# Altium schematic sheet 03_ICs.SchDoc: ICs
size A; Revision: A; SheetNumber: 3; SheetTotal: 4; ECE315_Project_Name: ECE453 F23 Base Project
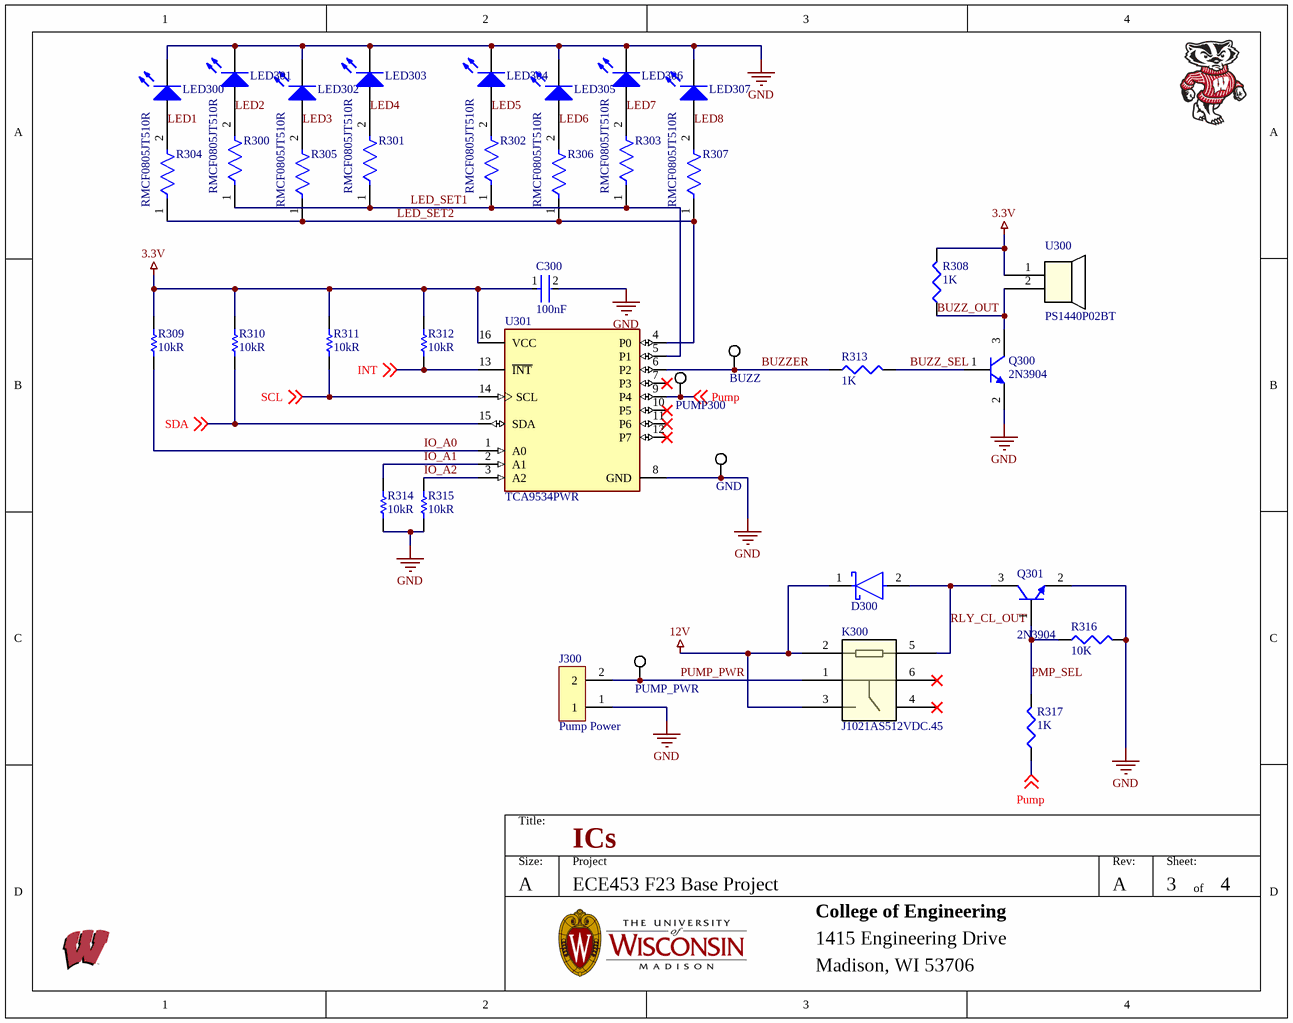
[diagram p0: 03_ICs.SchDoc]

## Parts
BUZZ  5019  [KSTN-5019_V]  (value not drawn)
C300  value 100nF  [FP-C0805C-DN-MFG]  (hidden comment: C0805C104K5RACTU)
D300  SM5817PL-TP  [On_Semiconductor_425-04_IPC_A]  (value not drawn)
GND  5019  [KSTN-5019_V]  (value not drawn)
J300  Pump Power  [PHOENIX2X0.2]
K300  J1021AS512VDC.45  [RELAY6_J102_CRS]
LED300  150080RS75000  [0805_A]  (value not drawn)
LED301  150080RS75000  [0805_A]  (value not drawn)
LED302  150080RS75000  [0805_A]  (value not drawn)
LED303  150080RS75000  [0805_A]  (value not drawn)
LED304  150080RS75000  [0805_A]  (value not drawn)
LED305  150080RS75000  [0805_A]  (value not drawn)
LED306  150080RS75000  [0805_A]  (value not drawn)
LED307  150080RS75000  [0805_A]  (value not drawn)
PUMP300  5019  [KSTN-5019_V]  (value not drawn)
PUMP_PWR  5019  [KSTN-5019_V]  (value not drawn)
Q300  2N3904  [SOT-23_M]
Q301  2N3904  [SOT-23_M]
R300  RMCF0805JT510R  [FP-RMCF0805-MFG]
R301  RMCF0805JT510R  [FP-RMCF0805-MFG]
R302  RMCF0805JT510R  [FP-RMCF0805-MFG]
R303  RMCF0805JT510R  [FP-RMCF0805-MFG]
R304  RMCF0805JT510R  [FP-RMCF0805-MFG]
R305  RMCF0805JT510R  [FP-RMCF0805-MFG]
R306  RMCF0805JT510R  [FP-RMCF0805-MFG]
R307  RMCF0805JT510R  [FP-RMCF0805-MFG]
R308  value 1K  [RES_0805]  (hidden comment: 10K)
R309  Resistance: 10kR  [RESC2013X60X35NL10T20]  (hidden comment: RC0805FR-0710KL)
R310  Resistance: 10kR  [RESC2013X60X35NL10T20]  (hidden comment: RC0805FR-0710KL)
R311  Resistance: 10kR  [RESC2013X60X35NL10T20]  (hidden comment: RC0805FR-0710KL)
R312  Resistance: 10kR  [RESC2013X60X35NL10T20]  (hidden comment: RC0805FR-0710KL)
R313  value 1K  [RES_0805]  (hidden comment: 10K)
R314  Resistance: 10kR  [RESC2013X60X35NL10T20]  (hidden comment: RC0805FR-0710KL)
R315  Resistance: 10kR  [RESC2013X60X35NL10T20]  (hidden comment: RC0805FR-0710KL)
R316  10K  [RES_0805]
R317  value 1K  [RES_0805]  (hidden comment: 10K)
U300  PS1440P02BT  [PS1440P02BT_TDK]
U301  TCA9534PWR  [FP-PW0016A-IPC_C]

## Nets
3.3V: C300.1 R308.2 R309.2 R310.2 R311.2 R312.2 U300.1 U301.16(VCC)
12V: D300.1(C) K300.2 K300.3
GND: C300.2 GND.1 J300.1 LED300.1(K) LED301.1(K) LED302.1(K) LED303.1(K) LED304.1(K) LED305.1(K) LED306.1(K) LED307.1(K) Q300.2(E) Q301.2(E) R314.1 R315.1 R316.2 U301.8(GND)
BUZZ_OUT: Q300.3(C) R308.1 U300.2
BUZZ_SEL: Q300.1(B) R313.2
BUZZER: BUZZ.1 R313.1 U301.6(P2)
INT: R312.1 U301.13(~{INT}) ; off-sheet INT
IO_A0: R309.1 U301.1(A0)
IO_A1: R314.2 U301.2(A1)
IO_A2: R315.2 U301.3(A2)
LED1: LED300.2(A) R304.2
LED2: LED301.2(A) R300.2
LED3: LED302.2(A) R305.2
LED4: LED303.2(A) R301.2
LED5: LED304.2(A) R302.2
LED6: LED305.2(A) R306.2
LED7: LED306.2(A) R303.2
LED8: LED307.2(A) R307.2
LED_SET1: R300.1 R301.1 R302.1 R303.1 U301.5(P1)
LED_SET2: R304.1 R305.1 R306.1 R307.1 U301.4(P0)
PMP_SEL: Q301.1(B) R316.1 R317.2
Pump: PUMP300.1 R317.1 U301.9(P4) ; off-sheet Pump
PUMP_PWR: J300.2 K300.1 PUMP_PWR.1
RLY_CL_OUT: D300.2(A) K300.5 Q301.3(C)
SCL: R311.1 U301.14(SCL) ; off-sheet SCL
SDA: R310.1 U301.15(SDA) ; off-sheet SDA

Not connected (* = marked no-connect by the designer): K300 4* 6*; U301 7(P3)* 10(P5)* 11(P6)* 12(P7)*

## Notes on the sheet
- Title:
- Size:
- A
- Project
- Rev:
- Sheet:
- of
- College of Engineering
- 1415 Engineering Drive
- Madison, WI 53706

## Library data of the parts
BUZZ GND PUMP300 PUMP_PWR = CMP-1672-00008-1: Test Point, 1 Position SMD, RoHS, Tape and Reel; Manufacturer: Keystone Electronics; Plating: Silver; Body Material: Bronze; Supplier: Newark; Supplier Part Number: 59Y8500; Manufacturer Part Number: 5019; RoHS: Yes; Category: Connectors; Stock: 11269; Pricing: 1=0.411, 10=0.389, 25=0.285, 50=0.279, 100=0.273, 250=0.246 (USD); Mounting Technology: Surface Mount,PCB; Pins: 1; Contact Plating: Silver; Contact Material: Bronze; Material: Bronze; Packaging: Tape and Reel; Package Quantity: 1; Termination: SMD/SMT; Series: 5019; Height: 0.09inch; Reach SVHC Compliant: No; RoHS Compliant: Yes; Lead Free: Lead Free; ComponentLink1URL: https://datasheet.ciiva.com/14848/m60-2p61-14848437.pdf?src-supplier=Digi-Key; ComponentLink1Description: https://datasheet.ciiva.com/14848/m60-2p61-14848437.pdf?src-supplier=Digi-Key; ComponentLink2URL: https://datasheet.ciiva.com/14848/m60-2p61-14848438.pdf?src-supplier=Digi-Key; ComponentLink2Description: https://datasheet.ciiva.com/14848/m60-2p61-14848438.pdf?src-supplier=Digi-Key; ComponentLink3URL: https://datasheet.ciiva.com/14848/m60-2p61-14848439.pdf?src-supplier=Digi-Key; ComponentLink3Description: https://datasheet.ciiva.com/14848/m60-2p61-14848439.pdf?src-supplier=Digi-Key; ComponentLink4URL: https://datasheet.ciiva.com/16318/m60-2p61-16318395.pdf?src-supplier=Future+Electronics; ComponentLink4Description: https://datasheet.ciiva.com/16318/m60-2p61-16318395.pdf?src-supplier=Future+Electronics; ComponentLink5URL: https://datasheet.ciiva.com/16885/70182998-16885945.pdf?src-supplier=Allied+Electronics; ComponentLink5Description: https://datasheet.ciiva.com/16885/70182998-16885945.pdf?src-supplier=Allied+Electronics
C300 = CMP-2007-00279-2: CAP CER 0.1UF 50V X7R 0805; Manufacturer: KEMET; Tolerance: 10%; Voltage: 500V; ComponentLink2Description: Datasheet; ComponentLink2URL: https://content.kemet.com/datasheets/KEM_C1003_C0G_SMD.pdf; Supplier: Newark; Supplier Part Number: 19C6015; Manufacturer Part Number: C0805C104K5RACTU; RoHS: Yes; Category: Ceramic Capacitors; Stock: 3382390; Pricing: 1=0.024, 25=0.024, 50=0.024, 100=0.024, 250=0.024, 500=0.024, 1000=0.024 (USD); Mounting Technology: Surface Mount,PCB; Case/Package: 0805; Pins: 2; Case Code (Imperial): 0805; Case Code (Metric): 2012; Min Operating Temperature: -55°C; Max Operating Temperature: 125°C; Package Quantity: 4000; Voltage Rating: 50V; Packaging: Tape and Reel; Voltage Rating (DC): 50V; Dielectric: X7R; Termination: SMD/SMT; Series: SMD Comm X7R; Construction: Flat; Length: 2mm; Width: 1.2mm; Height: 0.9mm; Lead Pitch: 0.75mm; Depth: 1.25mm; Radiation Hardening: No; RoHS Compliant: Yes; Reach SVHC Compliant: No; ComponentLink1URL: https://datasheet.ciiva.com/32431/slceramic-chip-condensers-e-32431755.pdf?src-supplier=Distrelec; ComponentLink1Description: https://datasheet.ciiva.com/32431/slceramic-chip-condensers-e-32431755.pdf?src-supplier=Distrelec; ComponentLink3URL: https://datasheet.ciiva.com/28682/1851736-28682232.pdf?src-supplier=Element14; ComponentLink3Description: https://datasheet.ciiva.com/28682/1851736-28682232.pdf?src-supplier=Element14
D300 = SM5817PL-TP: DIODE SCHOTTKY 20V 1A SOD123FL; Forward Voltage: 450mV; Max Surge Current: 30A; Element Configuration: Single; Manufacturer 2: MCC; Manufacturer Part Number 2: SM5817PL-TP; RoHS: Yes; Category: Rectifier Diodes; Stock 2: 178040; Pricing 2: 1=0.46000, 10=0.31900, 100=0.16110, 500=0.13144, 1000=0.09752 (USD); Mount: Surface Mount; Number of Pins: 2; Min Operating Temperature: -65°C; Max Operating Temperature: 125°C; Packaging: Tape and Reel; Package Quantity: 1; Average Rectified Current: 1A; Peak Non-Repetitive Surge Current: 30A; Max Reverse Voltage (DC): 20V; Reverse Voltage: 20V; Radiation Hardening: No; RoHS Compliant: Yes; ComponentLink1URL: https://datasheet.ciiva.com/15200/getdatasheetpartid-487494-15200581.pdf?src-supplier=Verical; ComponentLink1Description: https://datasheet.ciiva.com/15200/getdatasheetpartid-487494-15200581.pdf?src-supplier=Verical; ComponentLink2URL: https://datasheet.ciiva.com/912/sm5817pl-sm5819plsod-123fl-912827.pdf?src-supplier=Digi-Key; ComponentLink2Description: https://datasheet.ciiva.com/912/sm5817pl-sm5819plsod-123fl-912827.pdf?src-supplier=Digi-Key; Supplier 1: Digi-Key; Supplier Part Number 1: SM5817PL-TPMSCT-ND
J300 = 2-Pin: 2~24 Poles, Screw Type, Horizontal, 5.08 Pitch, 26~14 (AWG), Terminal Block Connector; Manufacturer: CUI Devices; Manufacturer Part Number: TB006-508-02BE; ComponentLink1URL: https://datasheet.ciiva.com/709/eng-cd-640456-w1-709680.pdf?src-supplier=Digi-Key; ComponentLink1Description: https://datasheet.ciiva.com/709/eng-cd-640456-w1-709680.pdf?src-supplier=Digi-Key; ComponentLink2URL: https://datasheet.ciiva.com/3118/eng-ds-82056-mta-0608-3118497.pdf?src-supplier=Avnet; ComponentLink2Description: https://datasheet.ciiva.com/3118/eng-ds-82056-mta-0608-3118497.pdf?src-supplier=Avnet; ComponentLink3URL: https://datasheet.ciiva.com/16401/eng-ds-82056-mta-0608-16401289.pdf?src-supplier=Future+Electronics; ComponentLink3Description: https://datasheet.ciiva.com/16401/eng-ds-82056-mta-0608-16401289.pdf?src-supplier=Future+Electronics; ComponentLink4URL: https://datasheet.ciiva.com/25617/0900766b80027008-25617244.pdf?src-supplier=RSComponents; ComponentLink4Description: https://datasheet.ciiva.com/25617/0900766b80027008-25617244.pdf?src-supplier=RSComponents; ComponentLink5URL: https://datasheet.ciiva.com/14156/04384301-14156820.pdf?src-supplier=Distrelec; ComponentLink5Description: https://datasheet.ciiva.com/14156/04384301-14156820.pdf?src-supplier=Distrelec; ComponentLink6URL: https://datasheet.ciiva.com/11746/0900766b80eb7fdd-11746365.pdf?src-supplier=RSComponents; ComponentLink6Description: https://datasheet.ciiva.com/11746/0900766b80eb7fdd-11746365.pdf?src-supplier=RSComponents; ComponentLink7URL: https://datasheet.ciiva.com/7128/1866390-7128742.pdf?src-supplier=Newark; ComponentLink7Description: https://datasheet.ciiva.com/7128/1866390-7128742.pdf?src-supplier=Newark; ComponentLink8URL: https://datasheet.ciiva.com/16505/eng-ds-82056-mta-0608-16505419.pdf?src-supplier=Avnet+Asia; ComponentLink8Description: https://datasheet.ciiva.com/16505/eng-ds-82056-mta-0608-16505419.pdf?src-supplier=Avnet+Asia; Supplier: Digi-Key; RoHS: Yes; Category: Terminal Blocks; Stock 1: 50889; Pricing 1: 1=0.86, 10=0.472, 25=0.3524, 50=0.3142, 100=0.308, 250=0.27108, 500=0.24644, 1000=0.2218, 5000=0.16635 (USD); Supplier Part Number: 102-6191-ND
K300 = J1021AS512VDC.45: No Description Available; Mfr_Name: CIT Relay & Switch; Type: DEV; Copyright: Copyright (C) 2023 Ultra Librarian. All rights reserved.; Manufacturer_Part_Number: J1021AS512VDC.45; RefDes: RefDes
LED300-LED307 = CMP-1426-00011-1: SMD mono-color Chip LED, WL-SMCW, Red; Manufacturer: Wuerth Elektronik; Manufacturer 1: Wurth Electronics; Luminous Intensity: 150mcd; Viewing Angle: 140°; Forward Voltage: 2V; Lens Style: Clear,Rectangular; Forward Current: 30mA; Dominant Wavelength: 625nm; Test Current: 20mA; Lens Color: Colorless; Lens Transparency: Clear; Lens Size: 1.25mm; Color: Red; PartNumber: 150080RS75000; PackageReference: 0805_A; ComponentLink2Description: Datasheet; ComponentLink1URL: http://www.we-online.com; ComponentLink1Description: Manufacturer URL; ComponentLink2URL: http://katalog.we-online.com/led/datasheet/150080RS75000.pdf; Supplier 1: Digi-Key; Supplier Part Number 1: 732-4984-1-ND; Manufacturer Part Number 1: 150080RS75000; RoHS: Yes; Category: LEDs; Stock 1: 100282; Pricing 1: 1=0.19000, 50=0.17600, 100=0.15100, 500=0.13100 (USD); Mount: Surface Mount; Case/Package: 0805; Case Code (Metric): 2012; Case Code (Imperial): 0805; Min Operating Temperature: -40°C; Max Operating Temperature: 85°C; Packaging: Tape and Reel; Wavelength: 625nm; Package Quantity: 4000; Length: 2mm; Width: 1.25mm; Height: 0.7mm; RoHS Compliant: Yes; REACH SVHC: Unknown; ComponentLink3URL: https://datasheet.ciiva.com/22656/150080rs75000-22656961.pdf?src-supplier=Element14; ComponentLink3Description: https://datasheet.ciiva.com/22656/150080rs75000-22656961.pdf?src-supplier=Element14; ComponentLink4URL: https://datasheet.ciiva.com/29279/759435-da-01-en-chipled-0805-w-kl-rot-150080rs75000-29279032.pdf?src-supplier=Conrad; ComponentLink4Description: https://datasheet.ciiva.com/29279/759435-da-01-en-chipled-0805-w-kl-rot-150080rs75000-29279032.pdf?src-supplier=Conrad; Supplier: Newark; Supplier Part Number: 95W3801; Manufacturer Part Number: 150080RS75000; Stock: 14062; Pricing: 1=0.194, 5=0.194, 10=0.191, 25=0.186, 50=0.18, 100=0.154 (USD); Mounting Technology: Surface Mount; Series: WL-SMCW; Reach SVHC Compliant: Unknown
Q300 Q301 = 2N3904: NPN General Purpose Amplifier; Manufacturer Part Number: MMBT3904-7-F; Manufacturer: Diodes Incorporated; Frequency - Transition: 300MHz; Power - Max: 300mW; DC Current Gain (hFE) (Min) @ Ic, Vce: 100 @ 10mA, 1V; Current - Collector Cutoff (Max): 50nA (ICBO); Vce Saturation (Max) @ Ib, Ic: 300mV @ 5mA, 50mA; Voltage - Collector Emitter Breakdown (Max): 40V; Current - Collector (Ic) (Max): 200mA; Supplier Device Package: SOT-23-3; Mounting Type: Surface Mount; Transistor Type: NPN; Packaging: Cut Tape (CT); RoHS: RoHS Compliant; Package / Case: TO-236-3, SC-59, SOT-23-3; Supplier Part Number: MMBT3904-FDICT-ND; Supplier: Digi-Key; Category: Discrete Semiconductor Products; Value: 2N3904
R300-R307 = CMP-26527-004489-1: 510Ω ±5% 0.125W 0805 Thick Film Chip Resistor AEC-Q200 compliant; Max Power Dissipation: 125mW; Temperature Coefficient: 200ppm/°C; Resistance: 510R; Construction: Rectangular; Packaging: Tape and Reel; Case Code (Imperial): 0805; Features: Automotive AEC-Q200; Mount: Surface Mount; Resistor Type: Thick Film; Min Operating Temperature: -55°C; Lead Free: Lead Free; Contact Plating: Tin; Width: 0.049inch; Depth: 1.25mm; Length: 0.079inch; Radiation Hardening: No; Size Code: 0805; Series: RMCF; Case Code (Metric): 2012; Number of Terminations: 2; Case/Package: 0805; RoHS Compliant: Yes; Max Operating Temperature: 155°C; Tolerance: 5%; Military Standard: Not; Height: 0.026inch; Power Rating: 125mW
R308 R313 R317 = Res3_1: Res Thick Film 0805 1K Ohm 1% 0.125W(1/8W) ±100ppm/C Pad SMD Automotive T/R; Manufacturer: Stackpole Electronics; Manufacturer Part Number: RMCF0805FT1K00; Power Rating: 125mW; Temperature Coefficient: 100ppm/°C; Supplier 1: Digi-Key; Supplier Part Number 1: RMCF0805FT1K00CT-ND; RoHS: Yes; Category: Chip SMD Resistors; Stock 1: 2773085; Pricing 1: 1=0.10000, 10=0.02400, 100=0.00970, 1000=0.00437, 2500=0.00379 (USD); Mounting Technology: Surface Mount; Case/Package: 0805; Case Code (Metric): 2012; Case Code (Imperial): 0805; Contact Plating: Tin,Matte; Min Operating Temperature: -55°C; Max Operating Temperature: 155°C; Tolerance: 1%; Packaging: Tape and Reel; Resistor Type: Thick Film; Number of Terminations: 2; Max Power Dissipation: 125mW; Features: Automotive AEC-Q200; Series: RMCF; Construction: Rectangular; Length: 2mm; Width: 0.049inch; Height: 0.026inch; Depth: 1.25mm; Radiation Hardening: No; Military Standard: Not; Lead Free: Lead Free; RoHS Compliant: Yes; ComponentLink1URL: https://datasheet.ciiva.com/15193/getdatasheetpartid-360136-15193546.pdf?src-supplier=Verical; ComponentLink1Description: https://datasheet.ciiva.com/15193/getdatasheetpartid-360136-15193546.pdf?src-supplier=Verical
R309-R312 R314 R315 = CMP-1659-00013-4: Chip Resistor, 10 KOhm, +/- 1%, 0.125 W, -55 to 155 degC, 0805 (2012 Metric), RoHS, Tape and Reel; Manufacturer: Yageo; Voltage Rating: 150 V; Temperature Coefficient: 100ppm/°C; Power Rating: 125mW; Value: 10kR; Mount: Surface Mount; ComponentLink1Description: Manufacturer URL; ComponentLink2URL: http://www.yageo.com/documents/recent/PYu-RC_Group_51_RoHS_L_04.pdf; Pins: 2; Length: 2 mm; Min Operating Temperature: -55 degC; Height: 0.5 mm; Mounting Technology: Surface Mount; RoHSCompliant: true; REACH SVHC: No SVHC; ComponentLink1URL: http://www.yageo.com/; Max Operating Temperature: 155 degC; PackageReference: 0805; DatasheetVersion: Rev. 4, 02/2016; Package Quantity: 5000; Packaging: Tape and Reel; ComponentLink2Description: Datasheet; PackageDescription: 2-Pin Surface Mounted Device, Body 2 x 1.25 mm; Supplier 1: Digi-Key; Supplier Part Number 1: 311-10.0KCRCT-ND; Manufacturer 1: Yageo; Manufacturer Part Number 1: RC0805FR-0710KL; RoHS: Yes; Category: Chip SMD Resistors; Stock 1: 5682818; Pricing 1: 1=0.10000, 10=0.03800, 100=0.01560, 1000=0.00702, 2500=0.00610 (USD); Case/Package: 0805; Case Code (Imperial): 0805; Case Code (Metric): 2012; Size Code: 0805; Tolerance: 1%; Resistor Type: Thick Film; Series: RC; Number of Terminations: 2; Max Power Dissipation: 125mW; Termination: SMD/SMT; Features: Moisture Resistant; Construction: Rectangular; Resistance Tolerance: 1%; Technology: THICK FILM; Width: 0.049inch; Depth: 1.25mm; RoHS Compliant: Yes; Military Standard: Not; Lead Free: Lead Free; ComponentLink3URL: https://datasheet.ciiva.com/11808/0900766b8106beab-11808151.pdf?src-supplier=RSComponents; ComponentLink3Description: https://datasheet.ciiva.com/11808/0900766b8106beab-11808151.pdf?src-supplier=RSComponents; ComponentLink4URL: https://datasheet.ciiva.com/46447/444164-46447563.pdf?src-supplier=Element14; ComponentLink4Description: https://datasheet.ciiva.com/46447/444164-46447563.pdf?src-supplier=Element14; ComponentLink5URL: https://datasheet.ciiva.com/2456/pyu-r-int-thick-7-2456973.pdf?src-supplier=Digi-Key; ComponentLink5Description: https://datasheet.ciiva.com/2456/pyu-r-int-thick-7-2456973.pdf?src-supplier=Digi-Key; ComponentLink6URL: https://datasheet.ciiva.com/2456/pyu-r-int-thick-7-2456974.pdf?src-supplier=Digi-Key; ComponentLink6Description: https://datasheet.ciiva.com/2456/pyu-r-int-thick-7-2456974.pdf?src-supplier=Digi-Key; ComponentLink7URL: https://datasheet.ciiva.com/2456/pyu-r-int-thick-7-2456972.pdf?src-supplier=Digi-Key; ComponentLink7Description: https://datasheet.ciiva.com/2456/pyu-r-int-thick-7-2456972.pdf?src-supplier=Digi-Key; ComponentLink8URL: https://datasheet.ciiva.com/12669/rc0805-12669688.pdf?src-supplier=Mouser; ComponentLink8Description: https://datasheet.ciiva.com/12669/rc0805-12669688.pdf?src-supplier=Mouser; ComponentLink9URL: https://datasheet.ciiva.com/16747/rc0805-16747087.pdf?src-supplier=Future+Electronics; ComponentLink9Description: https://datasheet.ciiva.com/16747/rc0805-16747087.pdf?src-supplier=Future+Electronics; Supplier: Newark; Supplier Part Number: 05M4535; Manufacturer Part Number: RC0805FR-0710KL; Stock: 346650; Pricing: 1=0.102, 10=0.035, 25=0.028, 50=0.021, 100=0.014 (USD); Reach SVHC Compliant: Unknown; ComponentLink10URL: https://datasheet.ciiva.com/11808/0900766b8106beab-11808151.pdf?src-supplier=Rs; ComponentLink10Description: https://datasheet.ciiva.com/11808/0900766b8106beab-11808151.pdf?src-supplier=Rs
R316 = Res3: Res Thick Film 0805 10K Ohm 1% 0.125W ±100ppm/°C Molded SMD Paper T/R; Manufacturer: Stackpole Electronics; Manufacturer Part Number: RMCF0805FT10K0; Power Rating: 125mW; ComponentLink1URL: https://datasheet.ciiva.com/15193/getdatasheetpartid-362046-15193525.pdf?src-supplier=Verical; ComponentLink1Description: https://datasheet.ciiva.com/15193/getdatasheetpartid-362046-15193525.pdf?src-supplier=Verical; Supplier 1: Digi-Key; Supplier Part Number 1: RMCF0805FT10K0CT-ND; RoHS: Yes; Category: Chip SMD Resistors; Stock 1: 3732463; Pricing 1: 1=0.10000, 10=0.02400, 100=0.00970, 1000=0.00437, 2500=0.00379 (USD); Mounting Technology: Surface Mount; Case/Package: 0805; Case Code (Metric): 2012; Case Code (Imperial): 0805; Contact Plating: Tin,Matte; Min Operating Temperature: -55°C; Max Operating Temperature: 155°C; Tolerance: 1%; Packaging: Tape and Reel; Resistor Type: Thick Film; Number of Terminations: 2; Temperature Coefficient: 100ppm/°C; Max Power Dissipation: 125mW; Features: Automotive AEC-Q200; Series: RMCF; Construction: Rectangular; Length: 2mm; Width: 0.049inch; Height: 0.026inch; Depth: 1.25mm; Radiation Hardening: No; Lead Free: Lead Free; Military Standard: Not; RoHS Compliant: Yes; Value: 10K
U300 = PS1440P02BT: No Description Available; Mfr_Name: TDK; Copyright: Copyright (C) 2023 Ultra Librarian. All rights reserved.; Manufacturer_Part_Number: PS1440P02BT; RefDes: RefDes; Type: DEV
U301 = CMP-04886-000003-2: IC I/O EXPANDER I2C 8B 16TSSOP; Manufacturer 1: Texas Instruments; Number of I/Os: 8; Frequency: 400kHz; Packaging: Tape and Reel; Number of Pins: 16; Min Operating Temperature: -40°C; RoHS Compliant: Yes; Number of Outputs: 8; Lead Free: Lead Free; Mount: Surface Mount; Max Operating Temperature: 85°C; Interface: I2C; Case/Package: TSSOP; Supplier 1: Digi-Key; Supplier Part Number 1: 296-40574-1-ND; Manufacturer Part Number 1: TCA9534PWR; RoHS: Yes; Category: Interface ICs; Stock 1: 63981; Pricing 1: 1=1.45000, 10=1.29500, 25=1.22880, 100=1.00930, 250=0.94352, 500=0.83380, 1000=0.66240 (USD); ComponentLink1URL: https://datasheet.ciiva.com/48508/tca9534-48508117.pdf?src-supplier=Avnet; ComponentLink1Description: https://datasheet.ciiva.com/48508/tca9534-48508117.pdf?src-supplier=Avnet